# Altium schematic sheet FunctionalSchematic.SchDoc: Sensors signals conditioning
size A3; Organization: Institut d'Automatisation Industrielle; SheetNumber: 2; SheetTotal: 3; SVN: OUI; CurrentTime: 6; CurrentDate: 5; DocumentFullPathAndName: 8; DocumentName: 9; ModifiedDate: 13; ProjectName: <projet>
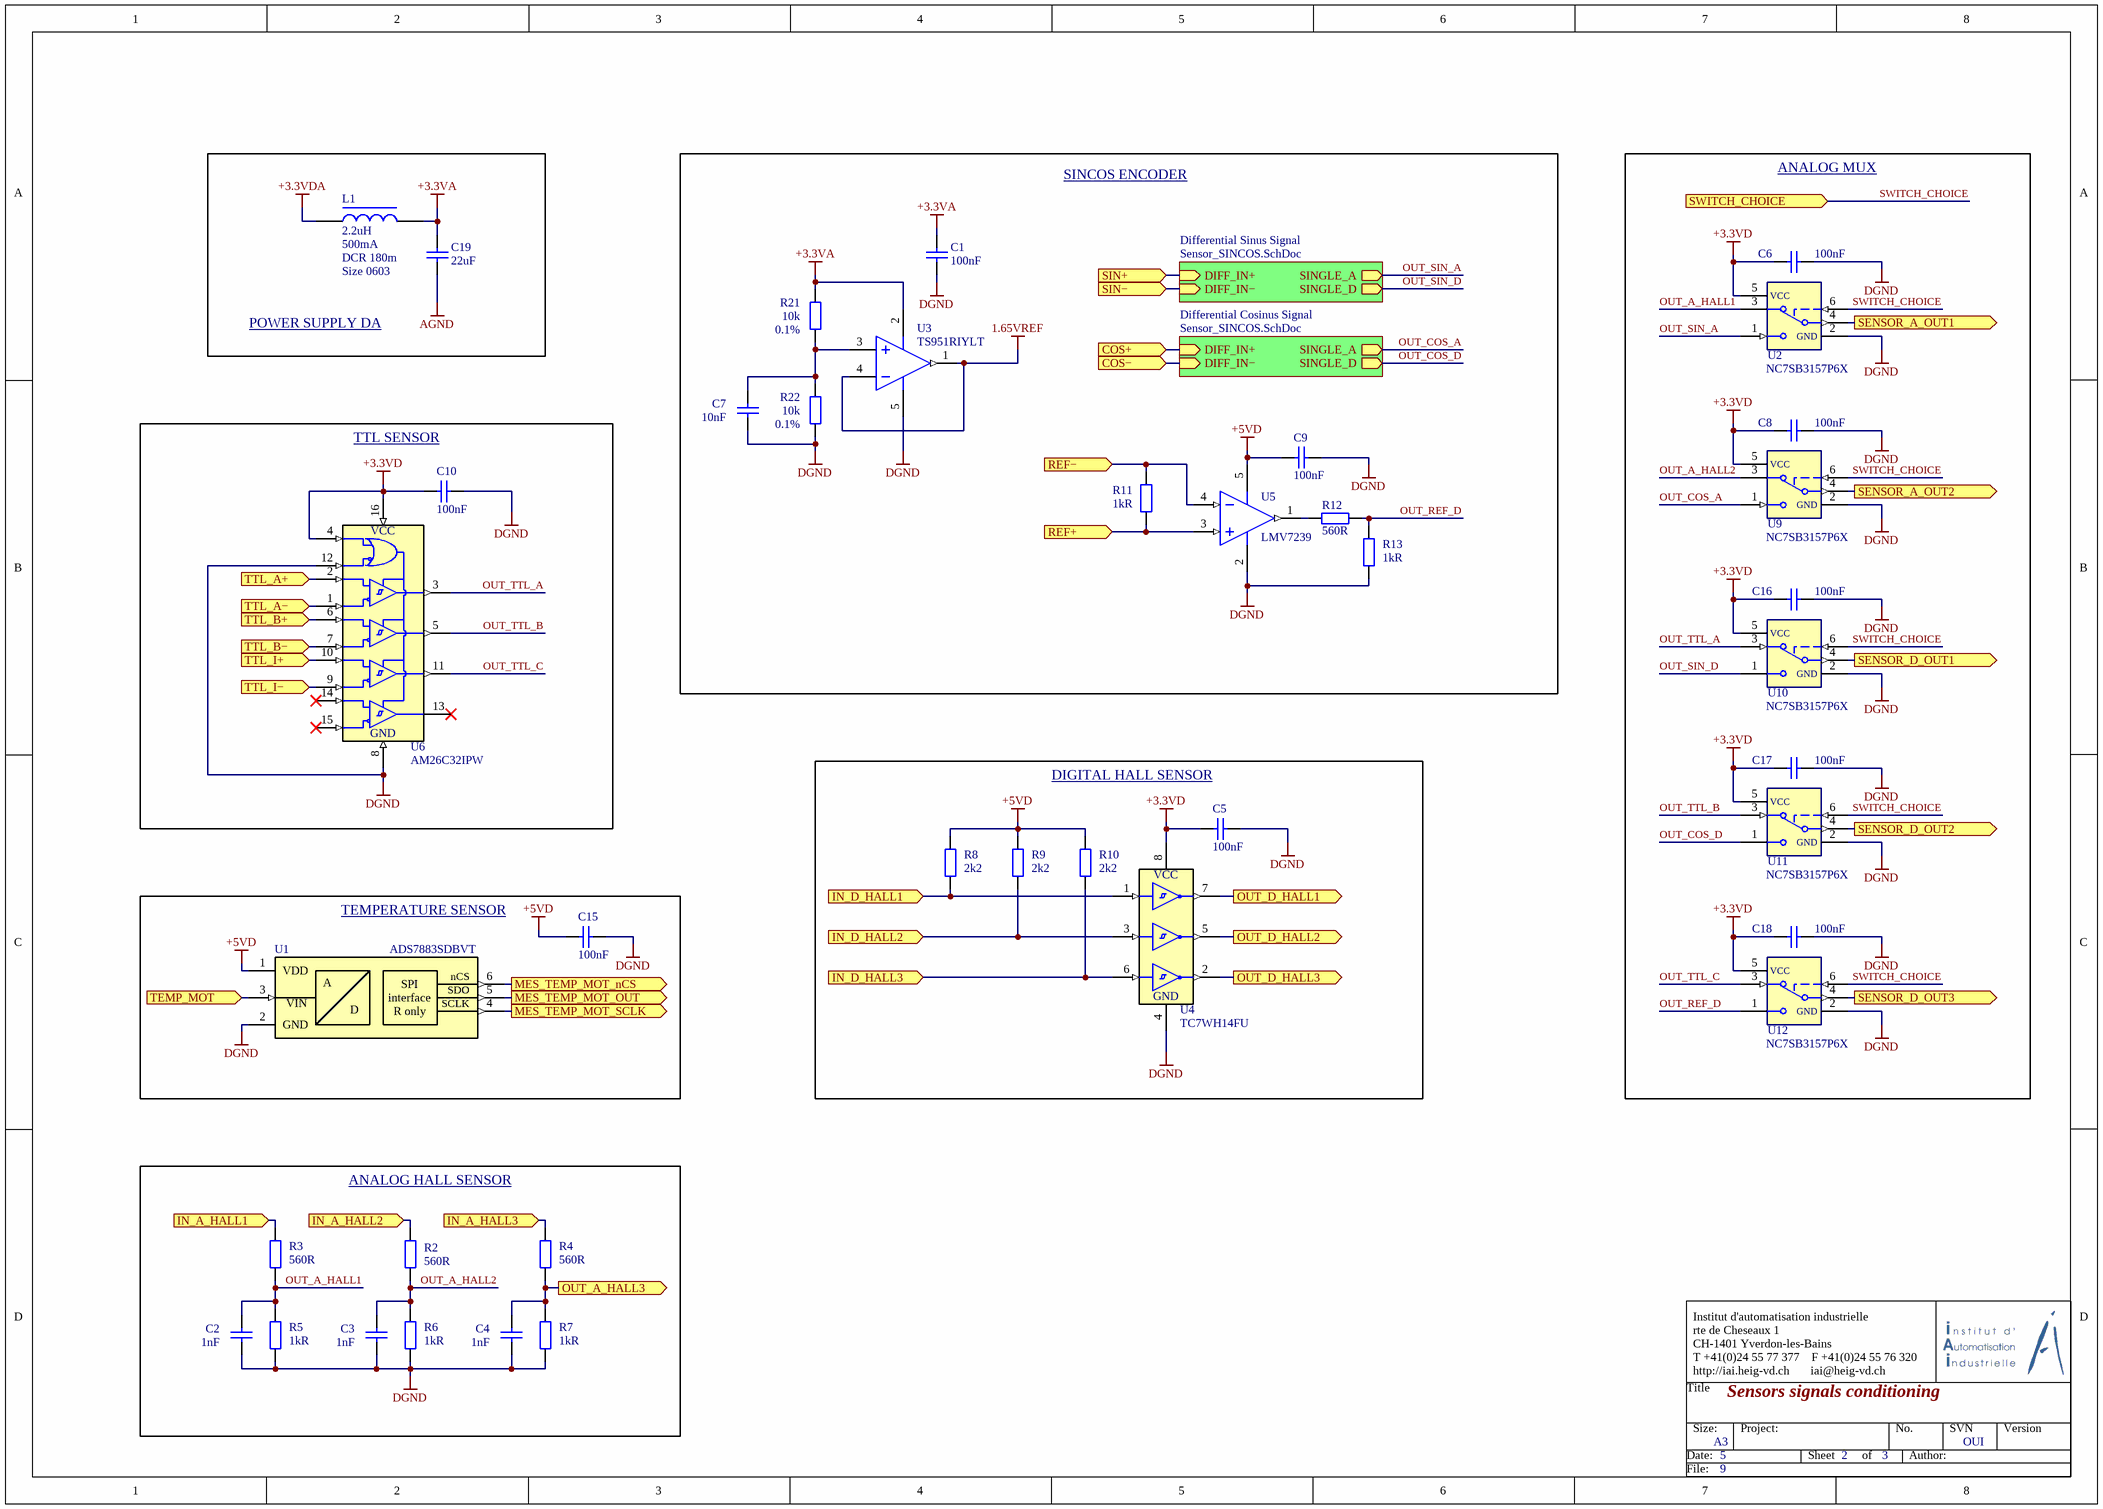
[diagram p0: FunctionalSchematic.SchDoc]

## Parts
C1  value 100nF  [CAPC1608X08N]  (hidden comment: CAP CER 0603)
C2  value 1nF  [CAPC1608X08N]  (hidden comment: CAP CER 1nF 0603)
C3  value 1nF  [CAPC1608X08N]  (hidden comment: CAP CER 1nF 0603)
C4  value 1nF  [CAPC1608X08N]  (hidden comment: CAP CER 1nF 0603)
C5  value 100nF  [CAPC1608X08N]  (hidden comment: CAP CER 100nF 0603)
C6  value 100nF  [CAPC1608X08N]  (hidden comment: CAP CER 100nF 0603)
C7  value 10nF  [CAPC1608X08N]  (hidden comment: CAP CER 0603)
C8  value 100nF  [CAPC1608X08N]  (hidden comment: CAP CER 100nF 0603)
C9  value 100nF  [CAPC1608X08N]  (hidden comment: CAP CER 100nF 0603)
C10  value 100nF  [CAPC1608X08N]  (hidden comment: CAP CER 100nF 0603)
C15  value 100nF  [CAPC1608X08N]  (hidden comment: CAP CER 100nF 0603)
C16  value 100nF  [CAPC1608X08N]  (hidden comment: CAP CER 100nF 0603)
C17  value 100nF  [CAPC1608X08N]  (hidden comment: CAP CER 100nF 0603)
C18  value 100nF  [CAPC1608X08N]  (hidden comment: CAP CER 100nF 0603)
C19  value 22uF  [CAPC1608X08N]  (hidden comment: CAP CER 22uF 0603)
L1  value 2.2uH  Current: 500mA  DCR: DCR 180m  Size: Size 0603  [INDC1608X10N]  (hidden comment: IND SMD 2.2uH 0603)
R2  value 560R  [RESC1508X04N]  (hidden comment: RES SMD 560R 0603)
R3  value 560R  [RESC1508X04N]  (hidden comment: RES SMD 560R 0603)
R4  value 560R  [RESC1508X04N]  (hidden comment: RES SMD 560R 0603)
R5  value 1kR  [RESC1508X04N]  (hidden comment: RES SMD 1K 0603)
R6  value 1kR  [RESC1508X04N]  (hidden comment: RES SMD 1K 0603)
R7  value 1kR  [RESC1508X04N]  (hidden comment: RES SMD 1K 0603)
R8  value 2k2  [RESC1508X04N]  (hidden comment: RES SMD 2K2 0603)
R9  value 2k2  [RESC1508X04N]  (hidden comment: RES SMD 2K2 0603)
R10  value 2k2  [RESC1508X04N]  (hidden comment: RES SMD 2K2 0603)
R11  value 1kR  [RESC1508X04N]  (hidden comment: RES SMD 1K 0603)
R12  value 560R  [RESC1508X04N]  (hidden comment: RES SMD 560R 0603)
R13  value 1kR  [RESC1508X04N]  (hidden comment: RES SMD 1K 0603)
R21  value 10k  Tolerance: 0.1%  [RESC1508X04N]  (hidden comment: RES SMD 0603)
R22  value 10k  Tolerance: 0.1%  [RESC1508X04N]  (hidden comment: RES SMD 0603)
U1  value ADS7883SDBVT  [SOT95P280X145-6N]  (hidden comment: IC ADC 12BIT)
U2  value NC7SB3157P6X  [SOT95P280X145-6N]  (hidden comment: Analog Switch 2:1 1ch)
U3  value TS951RIYLT  [SOT95P280X145-5N]  (hidden comment: OPAMP 1 CIRCUIT)
U4  value TC7WH14FU  [TSSOP50P310X100-8N]  (hidden comment: IC INVERTER 3CH)
U5  value LMV7239  [SOT95P280X145-5N]  (hidden comment: COMP 1 CIRCUIT)
U6  value AM26C32IPW  [TSOP65P640X120-16N]  (hidden comment: IC RECEIVER 0/4)
U9  value NC7SB3157P6X  [SOT95P280X145-6N]  (hidden comment: Analog Switch 2:1 1ch)
U10  value NC7SB3157P6X  [SOT95P280X145-6N]  (hidden comment: Analog Switch 2:1 1ch)
U11  value NC7SB3157P6X  [SOT95P280X145-6N]  (hidden comment: Analog Switch 2:1 1ch)
U12  value NC7SB3157P6X  [SOT95P280X145-6N]  (hidden comment: Analog Switch 2:1 1ch)

## Blocks framed on the sheet
POWER SUPPLY DA: C19 L1
SINCOS ENCODER: C1 C7 C9 R11-R13 R21 R22 U3 U5
ANALOG MUX: C6 C8 C16-C18 U2 U9-U12
TTL SENSOR: C10 U6
DIGITAL HALL SENSOR: C5 R8-R10 U4
TEMPERATURE SENSOR: C15 U1
ANALOG HALL SENSOR: C2-C4 R2-R7

## Sub-sheets
Differential Cosinus Signal = Sensor_SINCOS.SchDoc: DIFF_IN− (in), SINGLE_A (out), DIFF_IN+ (in), SINGLE_D (out)
Differential Sinus Signal = Sensor_SINCOS.SchDoc: DIFF_IN− (in), SINGLE_A (out), DIFF_IN+ (in), SINGLE_D (out)

## Ports
COS+ (in), COS− (in), IN_A_HALL1 (in), IN_A_HALL2 (in), IN_A_HALL3 (in), IN_D_HALL1 (in), IN_D_HALL2 (in), IN_D_HALL3 (in), MES_TEMP_MOT_nCS (out), MES_TEMP_MOT_OUT (out), MES_TEMP_MOT_SCLK (out), OUT_A_HALL3 (out), OUT_D_HALL1 (out), OUT_D_HALL2 (out), OUT_D_HALL3 (out), REF+ (in), REF− (in), SENSOR_A_OUT1 (out), SENSOR_A_OUT2 (out), SENSOR_D_OUT1 (out), SENSOR_D_OUT2 (out), SENSOR_D_OUT3 (out), SIN+ (in), SIN− (in), SWITCH_CHOICE (in), TEMP_MOT (in), TTL_A+ (in), TTL_A− (in), TTL_B+ (in), TTL_B− (in), TTL_I+ (in), TTL_I− (in)

## Nets
1.65VREF: U3.1(OUT) U3.4(IN-)
+3.3VA: C1.1 C19.2 L1.2 R21.2 U3.2(IN-)
+3.3VD: C5.2 C6.1 C8.1 C10.2 C16.1 C17.1 C18.1 U2.5(VCC) U4.8 U6.4 U6.16 U9.5(VCC) U10.5(VCC) U11.5(VCC) U12.5(VCC)
+3.3VDA: L1.1
+5VD: C9.1 C15.2 R8.2 R9.2 R10.2 U1.1(VDD) U5.5(IN-)
AGND: C19.1
DGND: C1.2 C2.1 C3.1 C4.1 C5.1 C6.2 C7.1 C8.2 C9.2 C10.1 C15.1 C16.2 C17.2 C18.2 R5.1 R6.1 R7.1 R13.1 R22.1 U1.2(GND) U2.2(GND) U3.5(IN-) U4.4 U5.2(IN-) U6.8 U6.12 U9.2(GND) U10.2(GND) U11.2(GND) U12.2(GND)
COS+: port COS+, sheet Differential Cosinus Signal/DIFF_IN+
COS−: port COS−, sheet Differential Cosinus Signal/DIFF_IN−
IN_A_HALL1: R3.2 ; port IN_A_HALL1
IN_A_HALL2: R2.2 ; port IN_A_HALL2
IN_A_HALL3: R4.2 ; port IN_A_HALL3
IN_D_HALL1: R8.1 U4.1 ; port IN_D_HALL1
IN_D_HALL2: R9.1 U4.3 ; port IN_D_HALL2
IN_D_HALL3: R10.1 U4.6 ; port IN_D_HALL3
MES_TEMP_MOT_nCS: U1.6(DOUT) ; port MES_TEMP_MOT_nCS
MES_TEMP_MOT_OUT: U1.5(nCS) ; port MES_TEMP_MOT_OUT
MES_TEMP_MOT_SCLK: U1.4(SCLK) ; port MES_TEMP_MOT_SCLK
OUT_A_HALL1: C2.2 R3.1 R5.2 U2.3(S1A)
OUT_A_HALL2: C3.2 R2.1 R6.2 U9.3(S1A)
OUT_A_HALL3: C4.2 R4.1 R7.2 ; port OUT_A_HALL3
OUT_COS_A: U9.1(S2A) ; sheet Differential Cosinus Signal/SINGLE_A
OUT_COS_D: U11.1(S2A) ; sheet Differential Cosinus Signal/SINGLE_D
OUT_D_HALL1: U4.7 ; port OUT_D_HALL1
OUT_D_HALL2: U4.5 ; port OUT_D_HALL2
OUT_D_HALL3: U4.2 ; port OUT_D_HALL3
OUT_REF_D: R12.1 R13.2 U12.1(S2A)
OUT_SIN_A: U2.1(S2A) ; sheet Differential Sinus Signal/SINGLE_A
OUT_SIN_D: U10.1(S2A) ; sheet Differential Sinus Signal/SINGLE_D
OUT_TTL_A: U6.3 U10.3(S1A)
OUT_TTL_B: U6.5 U11.3(S1A)
OUT_TTL_C: U6.11 U12.3(S1A)
REF+: R11.2 U5.3(IN+) ; port REF+
REF−: R11.1 U5.4(IN-) ; port REF−
SENSOR_A_OUT1: U2.4(D1) ; port SENSOR_A_OUT1
SENSOR_A_OUT2: U9.4(D1) ; port SENSOR_A_OUT2
SENSOR_D_OUT1: U10.4(D1) ; port SENSOR_D_OUT1
SENSOR_D_OUT2: U11.4(D1) ; port SENSOR_D_OUT2
SENSOR_D_OUT3: U12.4(D1) ; port SENSOR_D_OUT3
SIN+: port SIN+, sheet Differential Sinus Signal/DIFF_IN+
SIN−: port SIN−, sheet Differential Sinus Signal/DIFF_IN−
SWITCH_CHOICE: U2.6(IN1) U9.6(IN1) U10.6(IN1) U11.6(IN1) U12.6(IN1) ; port SWITCH_CHOICE
TEMP_MOT: U1.3(VIN) ; port TEMP_MOT
TTL_A+: U6.2 ; port TTL_A+
TTL_A−: U6.1 ; port TTL_A−
TTL_B+: U6.6 ; port TTL_B+
TTL_B−: U6.7 ; port TTL_B−
TTL_I+: U6.10 ; port TTL_I+
TTL_I−: U6.9 ; port TTL_I−
NetC7_2: C7.2 R21.1 R22.2 U3.3(IN+)
NetR12_2: R12.2 U5.1(OUT)

Not connected (* = marked no-connect by the designer): U6 13* 14* 15*

## Notes on the sheet
- Title
- Institut d'automatisation industrielle
  rte de Cheseaux 1
  CH-1401 Yverdon-les-Bains
  T +41(0)24 55 77 377    F +41(0)24 55 76 320
  http://iai.heig-vd.ch       iai@heig-vd.ch
- Date:
- Size:
- A3
- Project:
- Sheet
- of
- No.
- Author:
- SVN
- Version
- File:
- (in symbol IC ADC 12BIT SAR SOT23-6) SPI; A; interface; SDO; R only; D
- (in symbol IC INVERTER 3CH 3-INP US8) VCC; GND
- (in symbol IC RECEIVER 0/4 16TSSOP) VCC; GND

## Library data of the parts
C1 = CAP CER 100nF 5% 10V 0603
C2-C4 = CAP CER 1nF 10% 10V 0603: 1nF ±10% 10V Condensateurs céramique X7R 0603 (1608 métrique); Supplier 1: Digi-Key; Supplier Part Number 1: 399-8984-1-ND
C5 C6 C8-C10 C15-C18 = CAP CER 100nF 10% 10V 0603: 100nF ±10% 10V Condensateurs céramique X7R 0603 (1608 métrique); Supplier 1: Digi-Key; Supplier Part Number 1: 399-1095-1-ND
C7 = CAP CER 10nF 5% 10V 0603
C19 = CAP CER 47nF 10% 10V 0603: 22µF ±20% 6,3V Condensateurs céramique X5R 0603 (1608 métrique); Supplier 1: Digi-Key; Supplier Part Number 1: 399-14498-1-ND
L1 = IND SMD 150uH 1919
R2-R4 R12 = RES SMD 560 OHM 0.1% 1/10W 0603: 560 Ohms ±1% 0,1W, 1/10W Pavé résistif 0603 (1608 métrique) AutomobileAEC-Q200 Couche épaisse; Supplier 1: Digi-Key; Supplier Part Number 1: A139816CT-ND
R5-R7 R11 R13 = RES SMD 1K OHM 1% 1/10W 0603: 1 kOhms ±1% 0,1W, 1/10W Pavé résistif 0603 (1608 métrique) AutomobileAEC-Q200 Couche épaisse; Supplier 1: Digi-Key; Supplier Part Number 1: RMCF0603FT1K00CT-ND
R8-R10 = RES SMD 2K2 OHM 1% 1/10W 0603: 2,2 kOhms ±1% 0,1W, 1/10W Pavé résistif 0603 (1608 métrique) AutomobileAEC-Q200 Couche épaisse; Supplier 1: Digi-Key; Supplier Part Number 1: RMCF0603FT2K20CT-ND
R21 R22 = RES SMD 10K OHM 0.1% 1/10W 0603: 10 kOhms ±0,1% 0,1W, 1/10W Pavé résistif 0603 (1608 métrique) AutomobileAEC-Q200 Couche mince; Supplier 1: Digi-Key; Supplier Part Number 1: P10KBDCT-ND
U1 = IC ADC 12BIT SAR SOT23-6: 12 Bits, convertisseur analogique-numérique 1 Entrée 1 SAR SOT-23-6; Supplier 1: Digi-Key; Supplier Part Number 1: 296-23635-1-ND
U2 U9-U12 = IC SWITCH SPDT: 1 Circuits, circuit intégré, commutateur 2:1 15Ohms SC-88 (SC-70-6)
U3 = IC OPAMP GP 1 CIRCUIT SOT23-5: CMOS Amplificateurs 1 Circuits Pôle à pôle SOT-23-5; Supplier 1: Digi-Key; Supplier Part Number 1: 497-15708-1-ND
U4 = IC INVERTER 3CH 3-INP US8: Inverseur IC 3 Canal US8; Supplier 1: Digi-Key; Supplier Part Number 1: TC7WH14FULJ(CTCT-ND
U5 = IC COMP PUSH-PULL 1 CIRCUIT SOT-23-5: Comparateurs Usage général Pousser-tirer, rail-à-rail SOT-23-5; Supplier 1: Digi-Key; Supplier Part Number 1: LMV7239M5/NOPBCT-ND
U6 = IC RECEIVER 0/4 16TSSOP: Récepteur 0/4 RS422, RS423 16-TSSOP; Supplier 1: Digi-Key; Supplier Part Number 1: 296-25909-5-ND